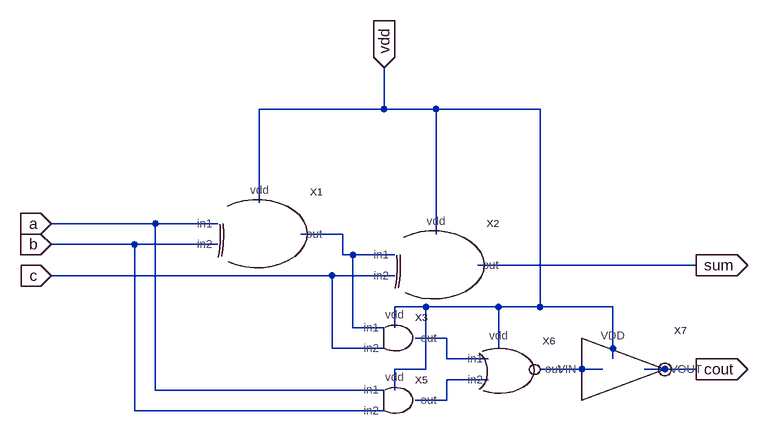
[diagram p0: schematic adder.asc]
adder.asc, the LTspice schematic file:
Version 4
SHEET 1 1028 680
WIRE 432 -128 432 -192
WIRE 432 -128 240 -128
WIRE 512 -128 432 -128
WIRE 672 -128 512 -128
WIRE 240 16 240 -128
WIRE 80 48 -80 48
WIRE 176 48 80 48
WIRE 368 64 304 64
WIRE 512 64 512 -128
WIRE 48 80 -80 80
WIRE 176 80 48 80
WIRE 368 96 368 64
WIRE 384 96 368 96
WIRE 448 96 384 96
WIRE 912 112 576 112
WIRE 352 128 -80 128
WIRE 448 128 352 128
WIRE 496 176 448 176
WIRE 608 176 496 176
WIRE 672 176 672 -128
WIRE 672 176 608 176
WIRE 784 176 672 176
WIRE 384 208 384 96
WIRE 432 208 384 208
WIRE 448 208 448 176
WIRE 528 224 480 224
WIRE 352 240 352 128
WIRE 432 240 352 240
WIRE 608 240 608 176
WIRE 528 256 528 224
WIRE 592 256 528 256
WIRE 784 256 784 176
WIRE 496 272 496 176
WIRE 496 272 448 272
WIRE 768 272 672 272
WIRE 912 272 832 272
WIRE 592 288 528 288
WIRE 80 304 80 48
WIRE 432 304 80 304
WIRE 448 304 448 272
WIRE 528 320 528 288
WIRE 528 320 480 320
WIRE 48 336 48 80
WIRE 432 336 48 336
FLAG -80 48 a
IOPIN -80 48 In
FLAG -80 80 b
IOPIN -80 80 In
FLAG -80 128 c
IOPIN -80 128 In
FLAG 912 112 sum
IOPIN 912 112 Out
FLAG 912 272 cout
IOPIN 912 272 Out
FLAG 432 -192 vdd
IOPIN 432 -192 In
SYMBOL and 448 224 R0
SYMATTR InstName X3
SYMBOL and 448 320 R0
SYMATTR InstName X5
SYMBOL nor 608 272 R0
SYMATTR InstName X6
SYMBOL inverter 784 272 R0
SYMATTR InstName X7
SYMBOL xor 240 64 R0
SYMATTR InstName X1
SYMBOL xor 512 112 R0
SYMATTR InstName X2

The netlist it stands for:
* adder.asc
XX3 N001 c vdd N002 and  ; pins in1 in2 vdd out
XX5 a b vdd N004 and  ; pins in1 in2 vdd out
XX6 N002 N004 vdd N003 nor  ; pins in1 in2 vdd out
XX7 vdd cout N003 inverter  ; pins VDD VOUT VIN
XX1 a b vdd N001 xor  ; pins in1 in2 vdd out
XX2 N001 c vdd sum xor  ; pins in1 in2 vdd out
.backanno
.end